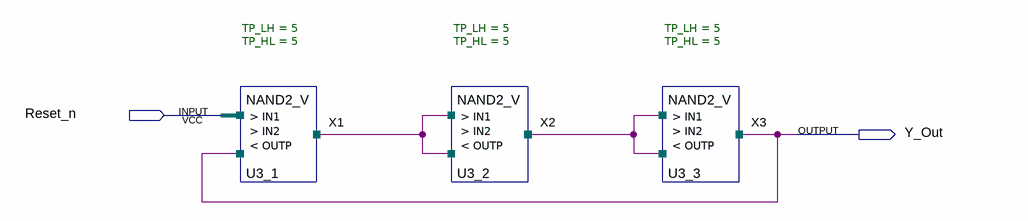
[diagram p0: schematic sheet]
// Quartus schematic ZVH_220_ROsz.bdf as structural Verilog: 3 symbols, 2 pins
module ZVH_220_ROsz (
  input  Reset_n,
  output Y_Out
);

  wire X1, X2;

  NAND2_V #(.TP_LH(5), .TP_HL(5)) U3_1 (.IN1(Reset_n), .IN2(Y_Out), .OUTP(X1));
  NAND2_V #(.TP_LH(5), .TP_HL(5)) U3_2 (.IN1(X1), .IN2(X1), .OUTP(X2));
  NAND2_V #(.TP_LH(5), .TP_HL(5)) U3_3 (.IN1(X2), .IN2(X2), .OUTP(Y_Out));

  // Other names for the same wires on the sheet: X3 = Y_Out
endmodule
